# Altium schematic sheet SFP Connector.SchDoc
size 209 x 297 mm; Author: ALTIUM GOSTBOM2.0 KEV; SheetNumber: 31; SheetTotal: 48
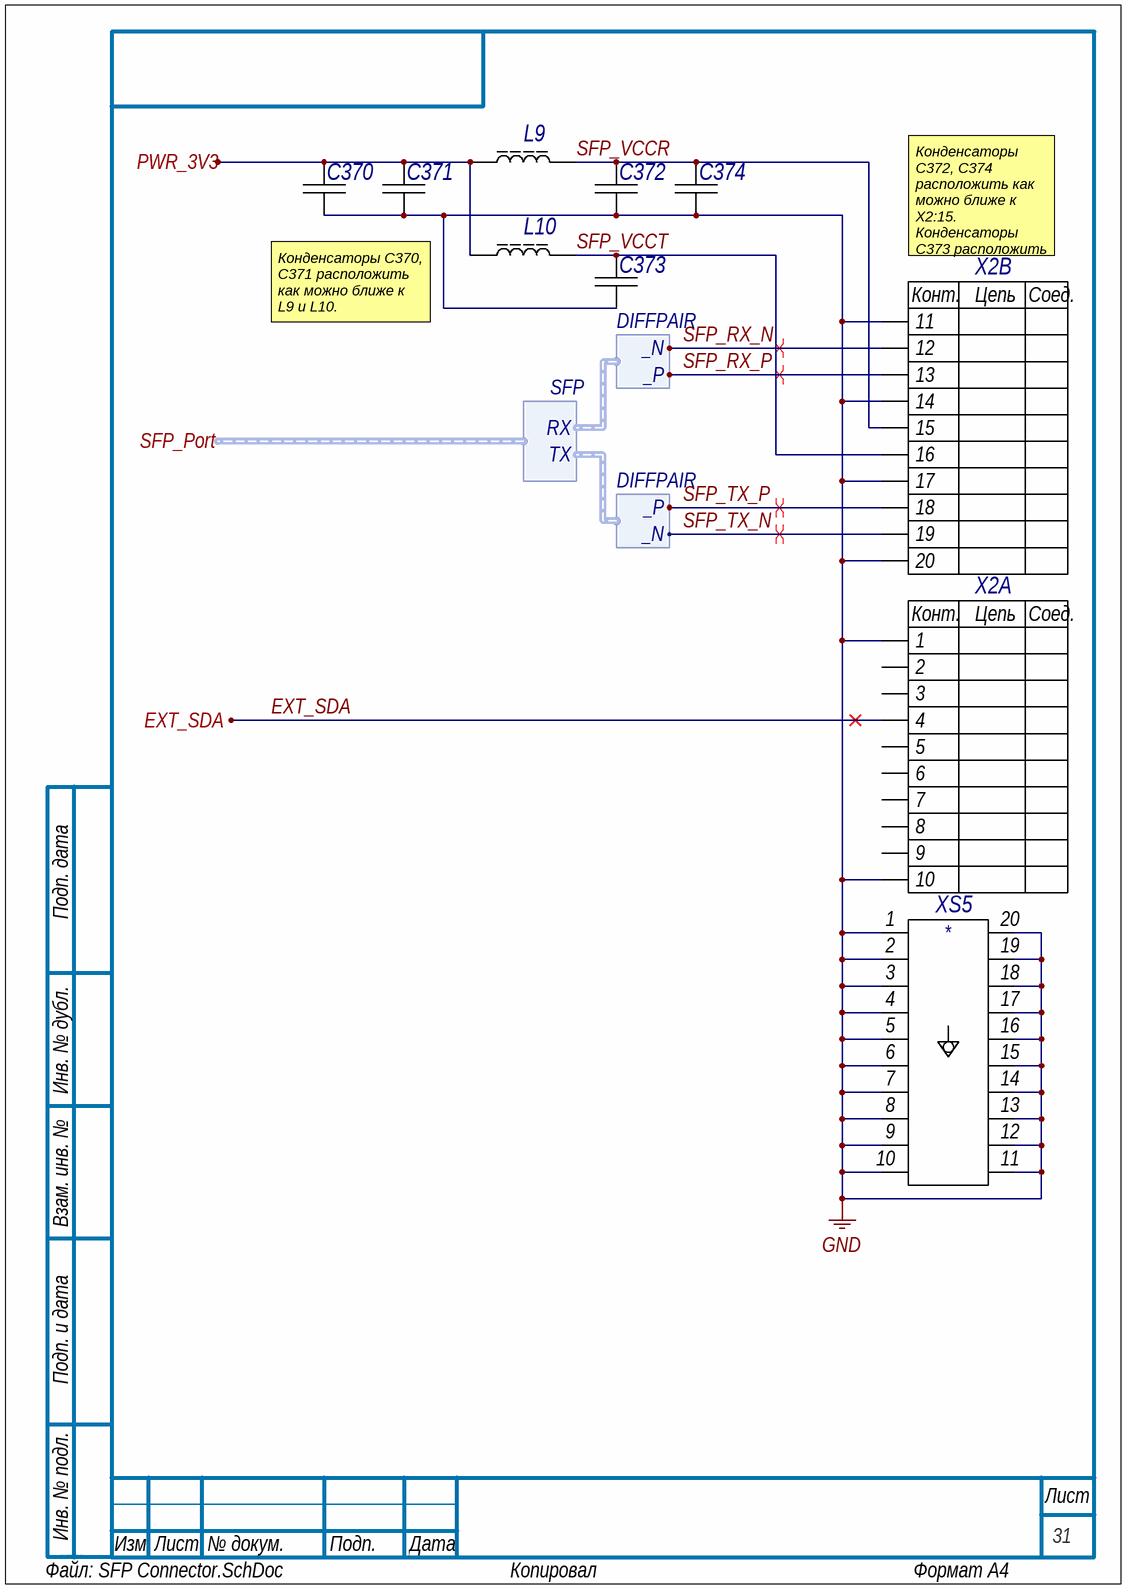
[diagram p0: SFP Connector.SchDoc]

## Parts
C370  C1005X7R1E104M  [CAPC1005X55X10LL05]  (value not drawn)
C371  C2012X5R1C106K085AC  [CAPC2013X100X20NL20]  (value not drawn)
C372  C1005X7R1E104M  [CAPC1005X55X10LL05]  (value not drawn)
C373  C1005X7R1E104M  [CAPC1005X55X10LL05]  (value not drawn)
C374  C2012X5R1C106K085AC  [CAPC2013X100X20NL20]  (value not drawn)
L9  1008CS-102XFLC  [COIL-1008CS_V]  (value not drawn)
L10  1008CS-102XFLC  [COIL-1008CS_V]  (value not drawn)
X2  MECT-110-01-M-D-RA1  [SMTC-MECT-110-01-M-D-RA1_V]  (value not drawn)  (parts A,B of 2)
XS5  74754-0101  [MOLX-74754-0101_V]  (value not drawn)

## Ports
EXT_SDA, PWR_3V3, SFP_Port (harness SFP)

## Harnesses
DIFFPAIR: _P, _N
SFP: RX, TX

## Nets
GND: C370.1 C371.1 C372.1 C373.1 C374.1 X2.1 X2.10 X2.11 X2.14 X2.17 X2.20 XS5.1 XS5.2 XS5.3 XS5.4 XS5.5 XS5.6 XS5.7 XS5.8 XS5.9 XS5.10 XS5.11 XS5.12 XS5.13 XS5.14 XS5.15 XS5.16 XS5.17 XS5.18 XS5.19 XS5.20
EXT_SDA: X2.4 ; port EXT_SDA
PWR_3V3: C370.2 C371.2 L9.1 L10.1 ; port PWR_3V3
SFP_RX_N: X2.12 ; harness DIFFPAIR._N
SFP_RX_P: X2.13 ; harness DIFFPAIR._P
SFP_TX_N: X2.19 ; harness DIFFPAIR._N
SFP_TX_P: X2.18 ; harness DIFFPAIR._P
SFP_VCCR: C372.2 C374.2 L9.2 X2.15
SFP_VCCT: C373.2 L10.2 X2.16

Not connected (* = marked no-connect by the designer): X2 2 3 5 6 7 8 9

## Layout directives
differential pair: SFP_RX_N, SFP_RX_P, SFP_TX_N, SFP_TX_P

## Notes on the sheet
- Конденсаторы C372, C374 расположить как можно ближе к X2:15.
  Конденсаторы C373 расположить как можно ближе к X2:16.
- Конденсаторы C370, C371 расположить как можно ближе к L9 и L10.
- Подп. дата
- Инв. № дубл.
- Взам. инв. №
- Подп. и дата
- Инв. № подл.
- Изм.
- Лист
- № докум.
- Подп.
- Дата
- Файл:
- ALTIUM GOSTBOM2.0 KEV
- Копировал
- Формат А4
- (in symbol E35, part A) Конт.; Цепь; Соед.
- (in symbol E35, part B) Конт.; Цепь; Соед.

## Library data of the parts
C370 = E11: Chip Capacitor, 0.1 uF, +/- 20%, 25 V, -55 to 125 degC, 0402 (1005 Metric), RoHS, Tape and Reel; Тип элемента: Конденсатор; Capacitance: 100 nF; Case\/Package: 0402; Type (Capacitors): X7R; Voltage Rating: 25 V; Old_des: C551; New_des: C379; UID: E11; Component Kind: Standard; Case Code (Imperial): 0402; Case Code (Metric): 1005; ComponentLink1Description: Manufacturer URL; ComponentLink1URL: http://www.tdk.com/; ComponentLink2Description: Datasheet; ComponentLink2URL: http://www.farnell.com/datasheets/1571323.pdf; DatasheetVersion: 09/2011; Length: 1 mm; Max Operating Temperature: 125 degC; Min Operating Temperature: -55 degC; Mounting Technology: Surface Mount; Package Quantity: 10000; PackageDescription: 2-Pin Surface Mount Device, Body 1 x 0.5 mm; Packaging: Tape and Reel; PartNumber: C1005X7R1E104M; RoHSCompliant: true; Tolerance: 20%; Width: 0.5 mm; Height: 0.5 mm; Mount: Surface Mount; PackageReference: 0402; Pins: 2; Voltage Rating (DC): 25 V
C371 = E25: Chip Capacitor, 10 uF, +/- 10%, 16 V, -55 to 85 degC, 0805 (2012 Metric), RoHS, Tape and Reel; Тип элемента: Конденсатор; Capacitance: 10 uF; Case\/Package: 0805; Type (Capacitors): X5R; Voltage Rating: 16 V; Old_des: C552; New_des: C380; UID: E25; Component Kind: Standard; Case Code (Imperial): 0805; Case Code (Metric): 2012; ComponentLink1Description: Manufacturer URL; ComponentLink1URL: http://www.tdk.com/; ComponentLink2Description: Datasheet; ComponentLink2URL: https://product.tdk.com/info/en/catalog/datasheets/mlcc_commercial_general_en.pdf; DatasheetVersion: 03/2015; Length: 2 mm; Max Operating Temperature: 85 degC; Min Operating Temperature: -55 degC; Mounting Technology: Surface Mount; Package Quantity: 1; PackageDescription: 2-Pin Surface Mount Device, Body 2 x 1.25 mm; Packaging: Tape and Reel; RoHSCompliant: true; Tolerance: 10%; Width: 1.25 mm; Height: 0.85 mm; Mount: Surface Mount; PackageReference: 0805; Pins: 2; REACH SVHC: No SVHC; Voltage Rating (DC): 16 V
C372 = E11: Chip Capacitor, 0.1 uF, +/- 20%, 25 V, -55 to 125 degC, 0402 (1005 Metric), RoHS, Tape and Reel; Тип элемента: Конденсатор; Capacitance: 100 nF; Case\/Package: 0402; Type (Capacitors): X7R; Voltage Rating: 25 V; Old_des: C553; New_des: C381; UID: E11; Component Kind: Standard; Case Code (Imperial): 0402; Case Code (Metric): 1005; ComponentLink1Description: Manufacturer URL; ComponentLink1URL: http://www.tdk.com/; ComponentLink2Description: Datasheet; ComponentLink2URL: http://www.farnell.com/datasheets/1571323.pdf; DatasheetVersion: 09/2011; Length: 1 mm; Max Operating Temperature: 125 degC; Min Operating Temperature: -55 degC; Mounting Technology: Surface Mount; Package Quantity: 10000; PackageDescription: 2-Pin Surface Mount Device, Body 1 x 0.5 mm; Packaging: Tape and Reel; PartNumber: C1005X7R1E104M; RoHSCompliant: true; Tolerance: 20%; Width: 0.5 mm; Height: 0.5 mm; Mount: Surface Mount; PackageReference: 0402; Pins: 2; Voltage Rating (DC): 25 V
C373 = E11: Chip Capacitor, 0.1 uF, +/- 20%, 25 V, -55 to 125 degC, 0402 (1005 Metric), RoHS, Tape and Reel; Тип элемента: Конденсатор; Capacitance: 100 nF; Case\/Package: 0402; Type (Capacitors): X7R; Voltage Rating: 25 V; Old_des: C550; New_des: C382; UID: E11; Component Kind: Standard; Case Code (Imperial): 0402; Case Code (Metric): 1005; ComponentLink1Description: Manufacturer URL; ComponentLink1URL: http://www.tdk.com/; ComponentLink2Description: Datasheet; ComponentLink2URL: http://www.farnell.com/datasheets/1571323.pdf; DatasheetVersion: 09/2011; Length: 1 mm; Max Operating Temperature: 125 degC; Min Operating Temperature: -55 degC; Mounting Technology: Surface Mount; Package Quantity: 10000; PackageDescription: 2-Pin Surface Mount Device, Body 1 x 0.5 mm; Packaging: Tape and Reel; PartNumber: C1005X7R1E104M; RoHSCompliant: true; Tolerance: 20%; Width: 0.5 mm; Height: 0.5 mm; Mount: Surface Mount; PackageReference: 0402; Pins: 2; Voltage Rating (DC): 25 V
C374 = E25: Chip Capacitor, 10 uF, +/- 10%, 16 V, -55 to 85 degC, 0805 (2012 Metric), RoHS, Tape and Reel; Тип элемента: Конденсатор; Capacitance: 10 uF; Case\/Package: 0805; Type (Capacitors): X5R; Voltage Rating: 16 V; Old_des: C554; New_des: C383; UID: E25; Component Kind: Standard; Case Code (Imperial): 0805; Case Code (Metric): 2012; ComponentLink1Description: Manufacturer URL; ComponentLink1URL: http://www.tdk.com/; ComponentLink2Description: Datasheet; ComponentLink2URL: https://product.tdk.com/info/en/catalog/datasheets/mlcc_commercial_general_en.pdf; DatasheetVersion: 03/2015; Length: 2 mm; Max Operating Temperature: 85 degC; Min Operating Temperature: -55 degC; Mounting Technology: Surface Mount; Package Quantity: 1; PackageDescription: 2-Pin Surface Mount Device, Body 2 x 1.25 mm; Packaging: Tape and Reel; RoHSCompliant: true; Tolerance: 10%; Width: 1.25 mm; Height: 0.85 mm; Mount: Surface Mount; PackageReference: 0805; Pins: 2; REACH SVHC: No SVHC; Voltage Rating (DC): 16 V
L9 = E49: Chip Inductor, 1000 nH, +/- 1%, -40 to 125 degC, 2-Pin SMD, RoHS, Tape and Reel; Тип элемента: Ферритовый дроссель; Inductance: 1000 nH; Old_des: L24; New_des: L10; UID: E49; Component Kind: Standard; ComponentLink1Description: Manufacturer URL; ComponentLink1URL: http://www.coilcraft.com/; ComponentLink2Description: Datasheet; ComponentLink2URL: http://datasheet.octopart.com/1008CS-102XFLC-Coilcraft-datasheet-10791557.pdf; DatasheetVersion: 01/2012; Mounting Technology: Surface Mount; PackageDescription: 2-Pin Surface Mount Device, Body 2.92 x 2.79 mm; PartNumber: 1008CS-102XFLC; RoHSCompliant: False
L10 = E49: Chip Inductor, 1000 nH, +/- 1%, -40 to 125 degC, 2-Pin SMD, RoHS, Tape and Reel; Тип элемента: Ферритовый дроссель; Inductance: 1000 nH; Old_des: L23; New_des: L11; UID: E49; Component Kind: Standard; ComponentLink1Description: Manufacturer URL; ComponentLink1URL: http://www.coilcraft.com/; ComponentLink2Description: Datasheet; ComponentLink2URL: http://datasheet.octopart.com/1008CS-102XFLC-Coilcraft-datasheet-10791557.pdf; DatasheetVersion: 01/2012; Mounting Technology: Surface Mount; PackageDescription: 2-Pin Surface Mount Device, Body 2.92 x 2.79 mm; PartNumber: 1008CS-102XFLC; RoHSCompliant: False
X2 = E35: Female Transceiver Interface, Pitch 0.8 mm, 2 x 10 Position, Height 5.2 mm, -55 to 125 degC, RoHS, Tube; Manufacturer: Samtec; Тип элемента: Соединитель; Old_des: J7; New_des: X2; UID: E35; Component Kind: Standard; ComponentLink1Description: Manufacturer URL; ComponentLink1URL: http://www.samtec.com/; ComponentLink2Description: Datasheet; ComponentLink2URL: http://suddendocs.samtec.com/catalog_english/mect.pdf; DatasheetVersion: Rev. Feb-16; Mounting Technology: Surface Mount; PackageDescription: Female Transceiver Interface, Pitch 0.8 mm, 2 x 10 Position, Height 5.2 mm; PartNumber: MECT-110-01-M-D-RA1; PackageReference: MECT-110-01-M-D-RA1; ComponentLink3Description: Package Specification; ComponentLink3URL: http://suddendocs.samtec.com/prints/mect-1xx-xx-xx-xx-d-rax-xx-footprint.pdf; PackageVersion: Rev. H, 06/2016
XS5 = E1: SFP+ Cage, Single Port, Height 10.85 mm, Tail Height 3.05 mm, -40 to 85 degC, RoHS, Tray; Manufacturer: Molex; Тип элемента: Корзина соединителя; Old_des: B1; New_des: XS5; UID: E1; Component Kind: Standard; ComponentLink1Description: Manufacturer URL; ComponentLink1URL: http://www.molex.com/; ComponentLink2Description: Datasheet; ComponentLink2URL: http://www.molex.com/webdocs/datasheets/pdf/en-us/0747540101_IO_CONNECTORS.pdf; DatasheetVersion: Rev. Jul-15; Mounting Technology: Through Hole; PackageDescription: SFP+ Cage, Single Port, Height 10.85 mm, Tail Height 3.05 mm; PartNumber: 74754-0101; PackageReference: 74754-0101; ComponentLink3Description: Package Specification; ComponentLink3URL: http://www.molex.com/pdm_docs/sd/747540101_sd.pdf; PackageVersion: Rev. J, 02/2015